# Altium schematic sheet CSP_inFET.SchDoc
size A4; DocumentNumber: 3; SheetNumber: 3; SheetTotal: 4
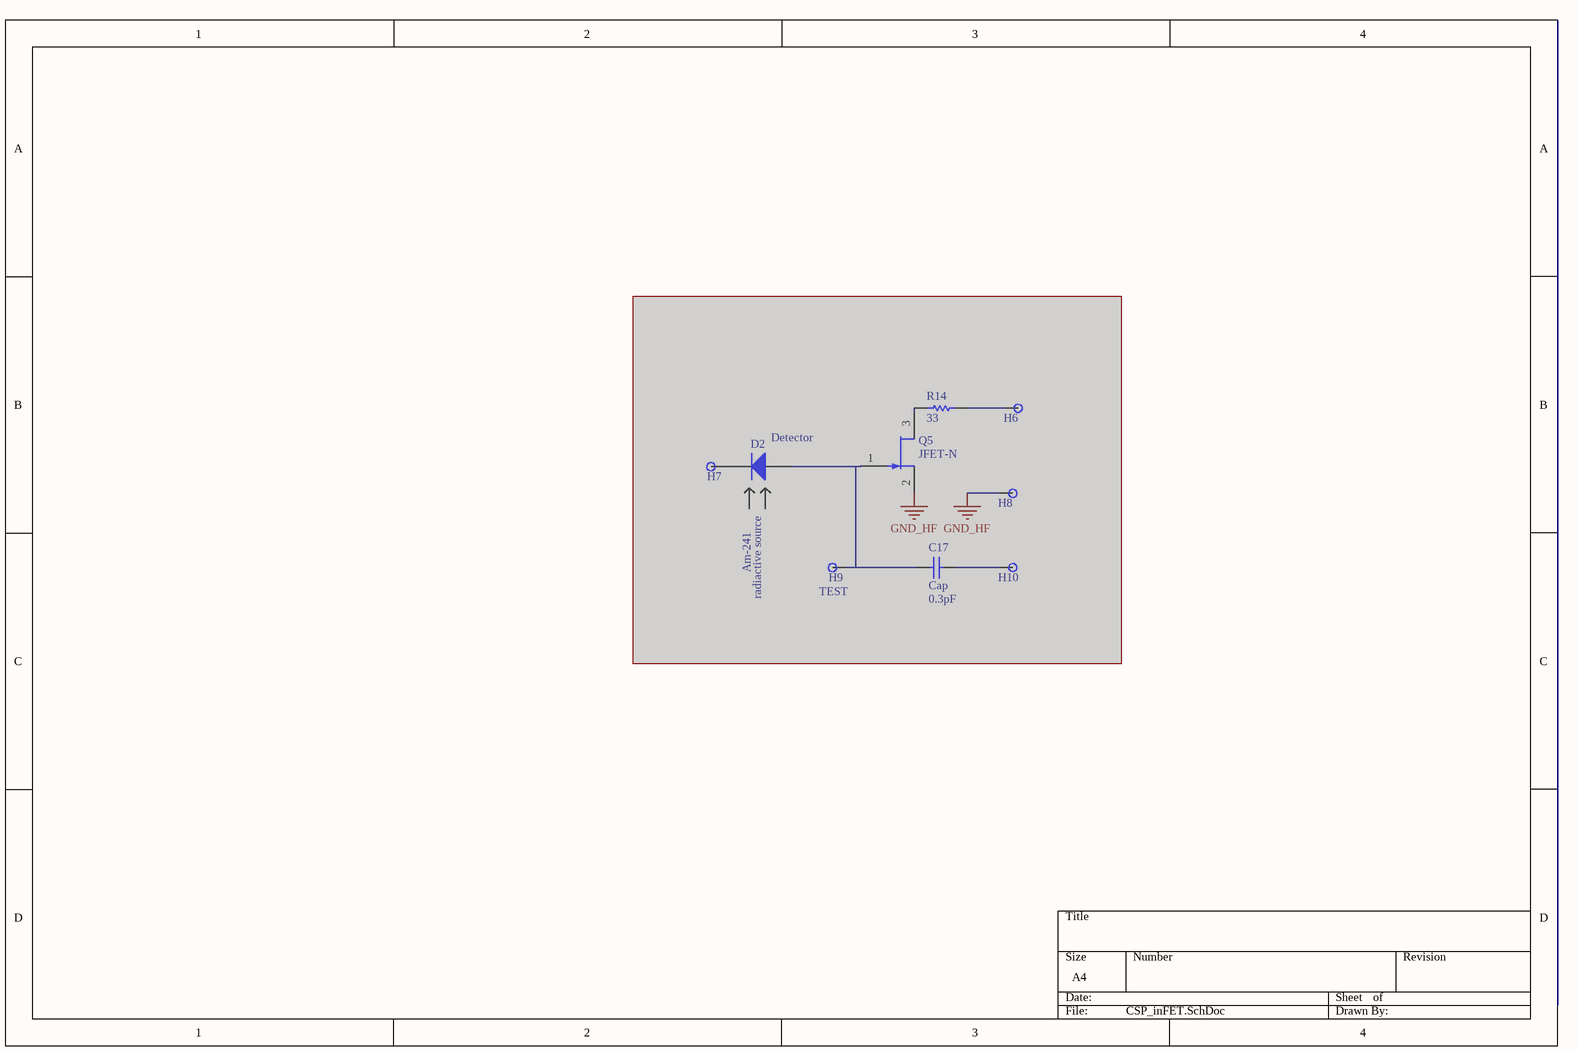
[diagram p0: CSP_inFET.SchDoc]

## Parts
C17  Cap  value 0.3pF  [CAPC160X80X90L35N]  (masked out: inside a compile mask, not in the netlist)
D2  Detector  [Detector]  (masked out: inside a compile mask, not in the netlist)
H6  PAD  [PAD_rounded]  (value not drawn)  (no BOM)  (masked out: inside a compile mask, not in the netlist)
H7  PAD  [PAD_rounded]  (value not drawn)  (no BOM)  (masked out: inside a compile mask, not in the netlist)
H8  PAD  [PAD_rounded]  (value not drawn)  (no BOM)  (masked out: inside a compile mask, not in the netlist)
H9  TEST  [PAD_rounded]  (no BOM)  (masked out: inside a compile mask, not in the netlist)
H10  PAD  [PAD_rounded]  (value not drawn)  (no BOM)  (masked out: inside a compile mask, not in the netlist)
Q5  JFET-N  [SOT23-3P95_240X114L20X40N]  (masked out: inside a compile mask, not in the netlist)
R14  33  [RESC200X125X70L40N]  (masked out: inside a compile mask, not in the netlist)

## Notes on the sheet
- Am-241
- radiactive source

## Library data of the parts
C17 = Cap: Capacitor; Published: 8-Jun-2000; LatestRevisionDate: 17-Jul-2002; LatestRevisionNote: Re-released for DXP Platform.; PackageReference: RAD-0.3; Publisher: Altium Limited; PackageDescription: Radial Cap, Thru-Hole; 2 Leads; 0.3 in Pin Spacing; LCSC Part #: *
D2 = Diode
H9 = PAD
Q5 = JFET-N: N-Channel JFET; Published: 8-Jun-2000; LatestRevisionDate: 17-Jul-2002; LatestRevisionNote: Re-released for DXP Platform.; PackageReference: TO-254-AA; Publisher: Altium Limited; Code_JEDEC: TO-254-AA; LCSC Part #: *
R14 = Res1: Resistor; Published: 8-Jun-2000; LatestRevisionDate: 17-Jul-2002; LatestRevisionNote: Re-released for DXP Platform.; PackageReference: AXIAL-0.3; Publisher: Altium Limited; PackageDescription: Axial Device, Thru-Hole; 2 Leads; 0.3 in Pin Spacing; Value: 33; LCSC Part #: *